# Altium schematic sheet 03_HDMI_TX.SchDoc
size OrCAD B
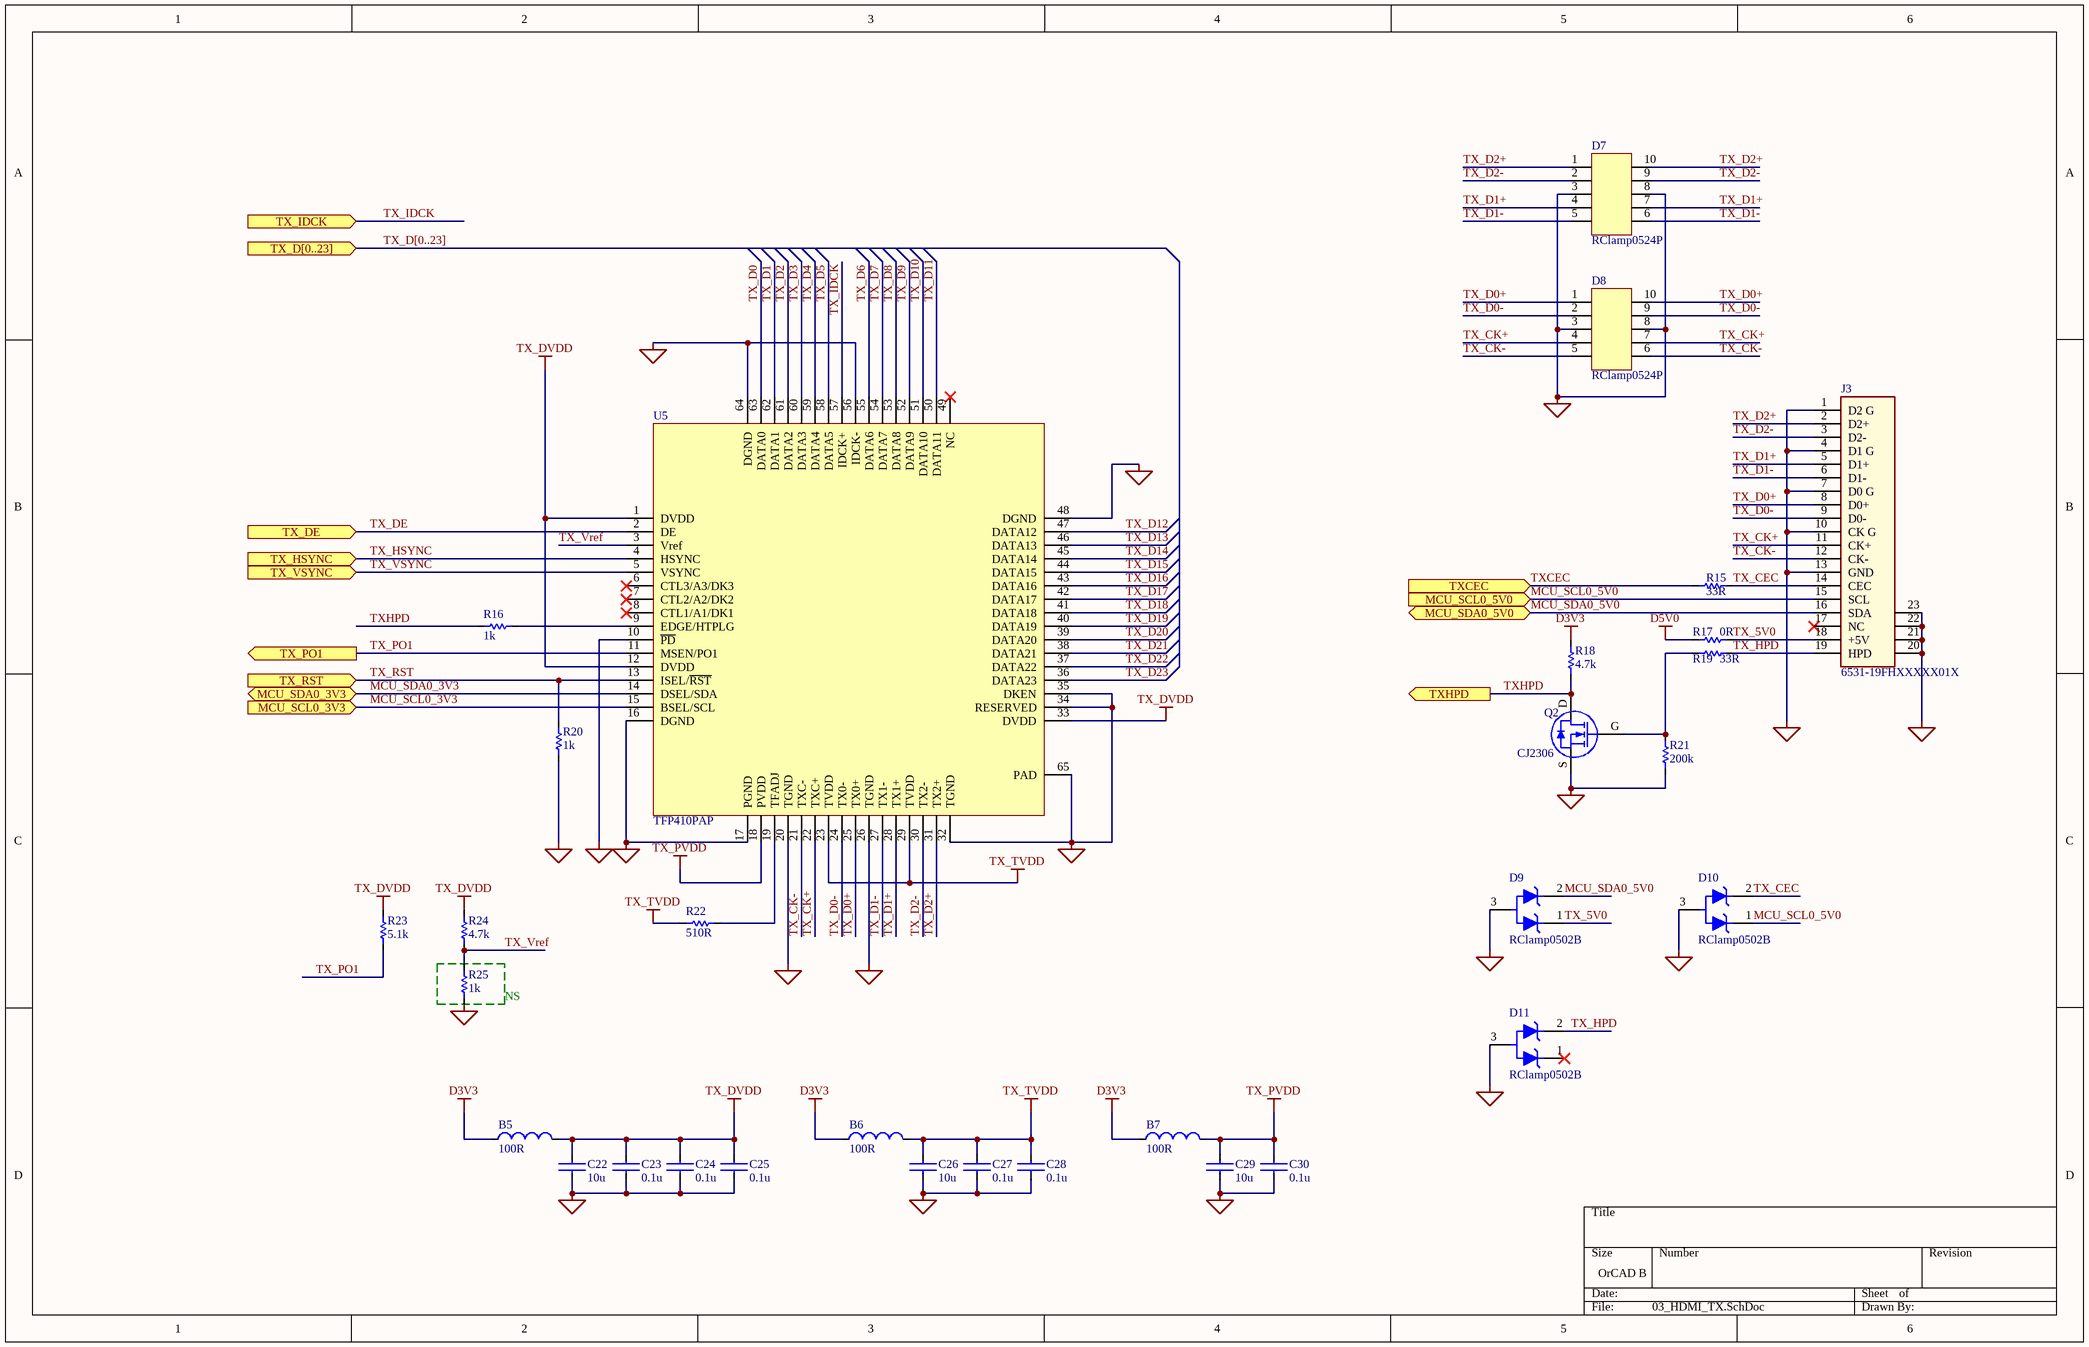
[diagram p0: 03_HDMI_TX.SchDoc]

## Parts
B5  100R  [INDC1608X09N_B0603_TAIYO]
B6  100R  [INDC1608X09N_B0603_TAIYO]
B7  100R  [INDC1608X09N_B0603_TAIYO]
C22  10u  [CAPC1608X09N_C0603]
C23  0.1u  [C0402]
C24  0.1u  [C0402]
C25  0.1u  [C0402]
C26  10u  [CAPC1608X09N_C0603]
C27  0.1u  [C0402]
C28  0.1u  [C0402]
C29  10u  [CAPC1608X09N_C0603]
C30  0.1u  [C0402]
D7  RClamp0524P  [SLP2510P8_RClamp0524P]
D8  RClamp0524P  [SLP2510P8_RClamp0524P]
D9  RClamp0502B  [SOTFL50P160X90-3N_RClamp0502B]
D10  RClamp0502B  [SOTFL50P160X90-3N_RClamp0502B]
D11  RClamp0502B  [SOTFL50P160X90-3N_RClamp0502B]
J3  6531-19FHXXXXX01X  [6531-19FHXXXXX01X]
Q2  CJ2306  [SOT95P240X115-3N_JCET_MOSFET]
R15  33R  [R0402]
R16  1k  [R0402]
R17  0R  [R0402]
R18  4.7k  [R0402]
R19  33R  [R0402]
R20  1k  [R0402]
R21  200k  [R0402]
R22  510R  [R0402]
R23  5.1k  [R0402]
R24  4.7k  [R0402]
R25  1k  [R0402]
U5  TFP410PAP  [TSQFP50P1200X1200X120_HS-65N_TFP410]

## Ports
MCU_SCL0_3V3 (in), MCU_SCL0_5V0 (in), MCU_SDA0_3V3 (bidir), MCU_SDA0_5V0 (bidir), TX_D[0..23] (in), TX_DE (in), TX_HSYNC (in), TX_IDCK (in), TX_PO1 (out), TX_RST (in), TX_VSYNC (in), TXCEC (in), TXHPD (out)

## Nets
D3V3: B5.2 B6.2 B7.2 R18.2
D5V0: R17.1
GND: C22.2 C23.2 C24.2 C25.2 C26.2 C27.2 C28.2 C29.2 C30.2 D7.3 D7.8 D8.3 D8.8 D9.3 D10.3 D11.3 J3.1(D2_G) J3.4(D1_G) J3.7(D0_G) J3.10(CK_G) J3.13(GND) J3.20 J3.21 J3.22 J3.23 Q2.S R20.1 R21.1 R25.1 U5.10(~{PD}) U5.16(DGND) U5.17(PGND) U5.20(TGND) U5.26(TGND) U5.32(TGND) U5.34(RESERVED) U5.35(DKEN) U5.48(DGND) U5.56(IDCK-) U5.64(DGND) U5.65(PAD)
TX_DVDD: B5.1 C22.1 C23.1 C24.1 C25.1 R23.2 R24.2 U5.1(DVDD) U5.12(DVDD) U5.33(DVDD)
TX_PVDD: B7.1 C29.1 C30.1 U5.18(PVDD)
TX_TVDD: B6.1 C26.1 C27.1 C28.1 R22.1 U5.23(TVDD) U5.29(TVDD)
MCU_SCL0_3V3: U5.15(BSEL/SCL) ; port MCU_SCL0_3V3
MCU_SCL0_5V0: D10.1 J3.15(SCL) ; port MCU_SCL0_5V0
MCU_SDA0_3V3: U5.14(DSEL/SDA) ; port MCU_SDA0_3V3
MCU_SDA0_5V0: D9.2 J3.16(SDA) ; port MCU_SDA0_5V0
TX_5V0: D9.1 J3.18(+5V) R17.2
TX_CEC: D10.2 J3.14(CEC) R15.2
TX_CK+: D8.4 D8.7 J3.11(CK+) U5.22(TXC+)
TX_CK-: D8.5 D8.6 J3.12(CK-) U5.21(TXC-)
TX_D0: U5.63(DATA0)
TX_D0+: D8.1 D8.10 J3.8(D0+) U5.25(TX0+)
TX_D0-: D8.2 D8.9 J3.9(D0-) U5.24(TX0-)
TX_D1: U5.62(DATA1)
TX_D1+: D7.4 D7.7 J3.5(D1+) U5.28(TX1+)
TX_D1-: D7.5 D7.6 J3.6(D1-) U5.27(TX1-)
TX_D2: U5.61(DATA2)
TX_D2+: D7.1 D7.10 J3.2(D2+) U5.31(TX2+)
TX_D2-: D7.2 D7.9 J3.3(D2-) U5.30(TX2-)
TX_D3: U5.60(DATA3)
TX_D4: U5.59(DATA4)
TX_D5: U5.58(DATA5)
TX_D6: U5.55(DATA6)
TX_D7: U5.54(DATA7)
TX_D8: U5.53(DATA8)
TX_D9: U5.52(DATA9)
TX_D10: U5.51(DATA10)
TX_D11: U5.50(DATA11)
TX_D12: U5.47(DATA12)
TX_D13: U5.46(DATA13)
TX_D14: U5.45(DATA14)
TX_D15: U5.44(DATA15)
TX_D16: U5.43(DATA16)
TX_D17: U5.42(DATA17)
TX_D18: U5.41(DATA18)
TX_D19: U5.40(DATA19)
TX_D20: U5.39(DATA20)
TX_D21: U5.38(DATA21)
TX_D22: U5.37(DATA22)
TX_D23: U5.36(DATA23)
TX_DE: U5.2(DE) ; port TX_DE
TX_HPD: D11.2 J3.19(HPD) R19.2
TX_HSYNC: U5.4(HSYNC) ; port TX_HSYNC
TX_IDCK: U5.57(IDCK+) ; port TX_IDCK
TX_PO1: R23.1 U5.11(MSEN/PO1) ; port TX_PO1
TX_RST: R20.2 U5.13(ISEL/~{RST}) ; port TX_RST
TX_Vref: R24.1 R25.2 U5.3(Vref)
TX_VSYNC: U5.5(VSYNC) ; port TX_VSYNC
TXCEC: R15.1 ; port TXCEC
TXHPD: Q2.D R16.1 R18.1 ; port TXHPD
NetQ2_G: Q2.G R19.1 R21.2
NetR16_2: R16.2 U5.9(EDGE/HTPLG)
NetR22_2: R22.2 U5.19(TFADJ)

Not connected (* = marked no-connect by the designer): D11 1(0)*; J3 17(NC)*; U5 6(CTL3/A3/DK3)* 7(CTL2/A2/DK2)* 8(CTL1/A1/DK1)* 49(NC)*

## Buses and harness runs
bus TX_D[0..23] = port TX_D[0..23]

## Notes on the sheet
- NS

## Library data of the parts
B5-B7 = FBMH1608HM101-T: Bead,100R,2500mA,0.035ohm,0603; Manufacturer1: YAIYO YUDEN; Manufacturer2: *; PartNumberManufacturer2: *; PartNumberManufacturer1: FBMH1608HM101-T; UnitPrice: *; Value: 100R
C22 C26 C29 = CAP113: CAP,Ceramic,X7R,10%,6.3V,10uF,0603; Manufacturer1: *; Manufacturer2: *; PartNumberManufacturer1: *; UnitPrice: *; Value: 10u
C23-C25 C27 C28 C30 = CAP011: CAP,Ceramic,X7R,10%,16V,0.1uF,0402; Manufacturer1: *; Manufacturer2: *; PartNumberManufacturer1: *; UnitPrice: *; Value: 0.1u
D7 D8 = RClamp0524P: TVS array,0.3pF,5V,SLP2510P8; Manufacturer1: SEMTECH; Manufacturer2: *; PartNumberManufacturer1: RClamp0524P; PartNumberManufacturer2: *; UnitPrice: *
D9-D11 = RClamp0502B: TVS array,1pF,5V,SC75; Manufacturer1: SEMTECH; Manufacturer2: *; PartNumberManufacturer1: RClamp0502B; PartNumberManufacturer2: *; UnitPrice: *
J3 = 6531-19FHXXXXX01X: Header,HDMI type C,19-Pin,Right angle,0.4mm Pitch,SMD; Manufacturer1: YTCO; Manufacturer2: *; PartNumberManufacturer1: 6531-19FHXXXXX01X; PartNumberManufacturer2: *; UnitPrice: *
Q2 = CJ2306: MOSFET,N Channel,3.16A,30V,SOT23; Manufacturer1: JCET; Manufacturer2: *; PartNumberManufacturer1: CJ2306; PartNumberManufacturer2: *; UnitPrice: *
R15 R19 = RES017: RES,33R,1%,1/16W,0402; Manufacturer1: *; PartNumberManufacturer2: *; Manufacturer2: *; PartNumberManufacturer1: *; Value: 33R; UnitPrice: *
R16 R20 R25 = RES011: RES,1k,1%,1/16W,0402; PartNumberManufacturer2: *; Manufacturer2: *; PartNumberManufacturer1: *; UnitPrice: *; Manufacturer1: *; Value: 1k
R17 = RES016: RES,0R,1%,1/16W,0402; Manufacturer1: *; PartNumberManufacturer2: *; Manufacturer2: *; PartNumberManufacturer1: *; Value: 0R; UnitPrice: *
R18 R24 = RES015: RES,4.7k,1%,1/16W,0402; Manufacturer1: *; PartNumberManufacturer2: *; Manufacturer2: *; PartNumberManufacturer1: *; Value: 4.7k; UnitPrice: *
R21 = RES0117: RES,200k,1%,1/16W,0402; Manufacturer1: *; PartNumberManufacturer2: *; Manufacturer2: *; PartNumberManufacturer1: *; Value: 200k; UnitPrice: *
R22 = RES0128: RES,510R,1%,1/16W,0402; PartNumberManufacturer2: *; Manufacturer2: *; PartNumberManufacturer1: *; UnitPrice: *; Manufacturer1: *; Value: 510R
R23 = RES014: RES,5.1k,1%,1/16W,0402; Manufacturer1: *; PartNumberManufacturer2: *; Manufacturer2: *; PartNumberManufacturer1: *; Value: 5.1k; UnitPrice: *
U5 = TFP410: IC,PanelBus Digital Transmitter,HTQFP64; Manufacturer1: Ti; Manufacturer2: *; PartNumberManufacturer1: TFP410PAP; PartNumberManufacturer2: *